# Altium schematic sheet Signals2uC.SchDoc
size A4
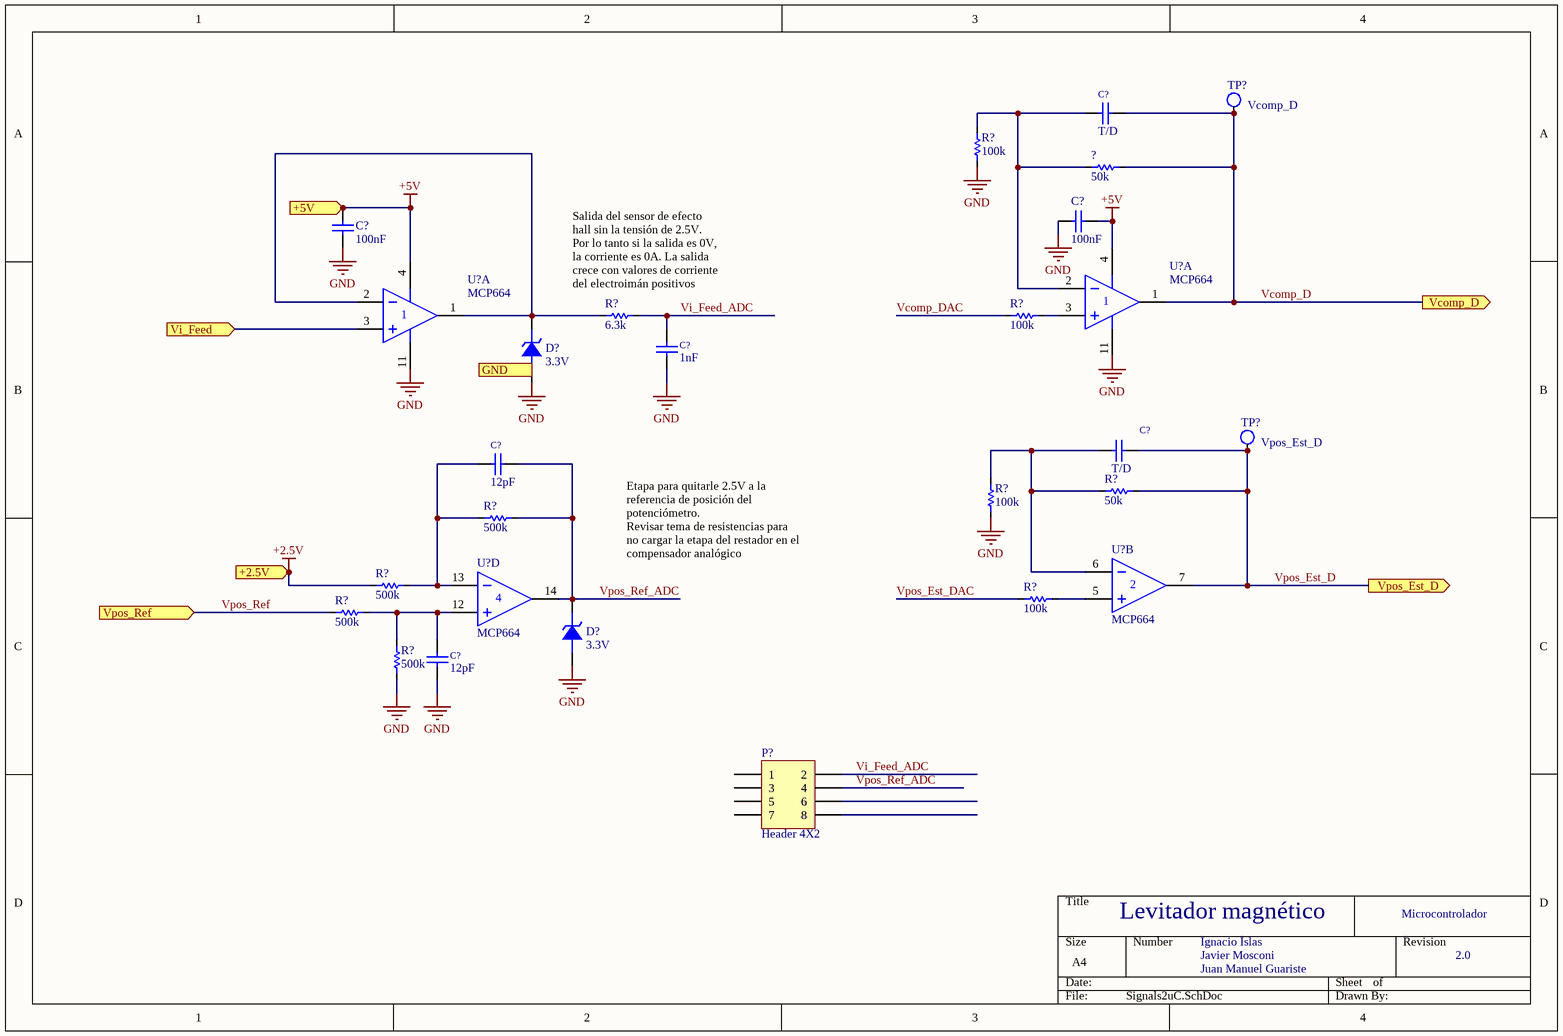
[diagram p0: Signals2uC.SchDoc]

## Parts
(Parts that share a designator on the sheet are numbered #1, #2 ... from top to bottom, then left to right.)
?  value 50k  [1206]  (hidden comment: Resistencia)
C?#1  T/D  [C1206]
C?#2  value 100nF  [R2012-0805]  (hidden comment: Capacitor)
C?#3  value 100nF  [R2012-0805]  (hidden comment: Capacitor)
C?#4  1nF  [C1206]
C?#5  T/D  [C1206]
C?#6  12pF  [C1206]
C?#7  12pF  [C1206]
D?#1  value 3.3V  [SMB]  (hidden comment: Diodo Zener)
D?#2  value 3.3V  [SMB]  (hidden comment: Diodo Zener)
P?  Header 4X2  [HDR2X4]
R?#1  value 100k  [1206]  (hidden comment: Resistencia)
R?#2  value 6.3k  [1206]  (hidden comment: Resistencia)
R?#3  value 100k  [1206]  (hidden comment: Resistencia)
R?#4  value 50k  [1206]  (hidden comment: Resistencia)
R?#5  value 500k  [1206]  (hidden comment: Resistencia)
R?#6  value 100k  [1206]  (hidden comment: Resistencia)
R?#7  value 500k  [1206]  (hidden comment: Resistencia)
R?#8  value 100k  [1206]  (hidden comment: Resistencia)
R?#9  value 500k  [1206]  (hidden comment: Resistencia)
R?#10  value 500k  [1206]  (hidden comment: Resistencia)
TP?#1  Vcomp_D  [TestPoint Keystone 5000 Silver-Red]
TP?#2  Vpos_Est_D  [TestPoint Keystone 5000 Silver-Red]
U?#1  MCP664  [SOIC14]  (part A of 4)
U?#2  MCP664  [SOIC14]  (part A of 4)
U?#3  MCP664  [SOIC14]  (part B of 4)
U?#4  MCP664  [SOIC14]  (part D of 4)

## Ports
+2.5V (in), +5V (in), GND (in), Vcomp_D (out), Vi_Feed (in), Vpos_Est_D (out), Vpos_Ref (in)

## Nets
+2.5V: R?#7.2 ; port +2.5V
+5V: C?#2.2 C?#3.1 U?#1.4(V+) U?#2.4(V+) ; port +5V
GND: C?#2.1 C?#3.2 C?#4.1 C?#7.2 D?#1.1 D?#2.1 R?#1.1 R?#6.1 R?#10.1 U?#1.11(V-) U?#2.11(V-)
Vcomp_D: ?.2 C?#1.1 TP?#1.1 U?#1.1(OUT) ; port Vcomp_D
Vcomp_DAC: R?#3.1
Vi_Feed: U?#2.3(IN+) ; port Vi_Feed
Vi_Feed_ADC: C?#4.2 P?.2 R?#2.1
Vpos_Est_D: C?#5.1 R?#4.2 TP?#2.1 U?#3.7(OUT) ; port Vpos_Est_D
Vpos_Est_DAC: R?#8.1
Vpos_Ref: R?#9.2 ; port Vpos_Ref
Vpos_Ref_ADC: C?#6.1 D?#2.2 P?.4 R?#5.2 U?#4.14(OUT)
Net?_1: ?.1 C?#1.2 R?#1.2 U?#1.2(IN-)
NetC?#5_2: C?#5.2 R?#4.1 R?#6.2 U?#3.6(IN-)
NetC?#6_2: C?#6.2 R?#5.1 R?#7.1 U?#4.13(IN-)
NetC?#7_1: C?#7.1 R?#9.1 R?#10.2 U?#4.12(IN+)
NetD?#1_2: D?#1.2 R?#2.2 U?#2.1(OUT) U?#2.2(IN-)
NetR?#3_2: R?#3.2 U?#1.3(IN+)
NetR?#8_2: R?#8.2 U?#3.5(IN+)

Not connected (* = marked no-connect by the designer): P? 1 3 5 6 7 8

## Notes on the sheet
- (near R?#2) Salida del sensor de efecto hall sin la tensión de 2.5V.
  Por lo tanto si la salida es 0V, la corriente es 0A. La salida crece con valores de corriente del electroimán positivos
- Etapa para quitarle 2.5V a la referencia de posición del potenciómetro.
  Revisar tema de resistencias para no cargar la etapa del restador en el compensador analógico
- Levitador magnético
- Microcontrolador
- Ignacio Islas
- Javier Mosconi
- Juan Manuel Guariste
- 2.0

## Library data of the parts
? R?#1-R?#10 = Resistencia: Manufacturer: Generic Components; Class I: Passive; Class II: Resistor; Published: 8-Jun-2000; Revision: July-2002: Re-released for DXP Platform.; Publisher: Altium Limited
C?#1 C?#4-C?#7 = C1206: Capacitor Chip 1206; Dielectric: NP0; Voltage: 50V; Published: 8-Jun-2000; LatestRevisionDate: 26/08/2013; LatestRevisionNote: IPC-7351 Footprint Added.; PackageReference: 1206; Publisher: Altium Limited; PackageDescription: Chip Capacitor; Supplier 1: Digi-Key
  C?#1 C?#5: Value: T/D
  C?#4: Value: 1nF
  C?#6 C?#7: Value: 12pF
C?#2 C?#3 = Capacitor: Manufacturer: Generic Components; Class: Passive; Published: 08/06/2000; Publisher: Altium Hobart Technology Centre; SubClass: Capacitor
D?#1 D?#2 = Diodo Zener: Diodo Zenner; Text Field1: 30; Text Field2: 20
P? = Header 4X2: Header, 4-Pin, Dual row; LatestRevisionDate: 17-Jul-2002; LatestRevisionNote: Re-released for DXP Platform.; Publisher: Altium Limited
TP?#1 TP?#2 = Tespoint: Test point; Link: https://www.digikey.com/en/products/detail/keystone-electronics/5000/255326
U?#1-U?#4 = MCP664: Datasheet: https://ar.mouser.com/datasheet/2/268/22194B-77503.pdf